# Altium schematic sheet ASBB_BMP388.SchDoc
size A4
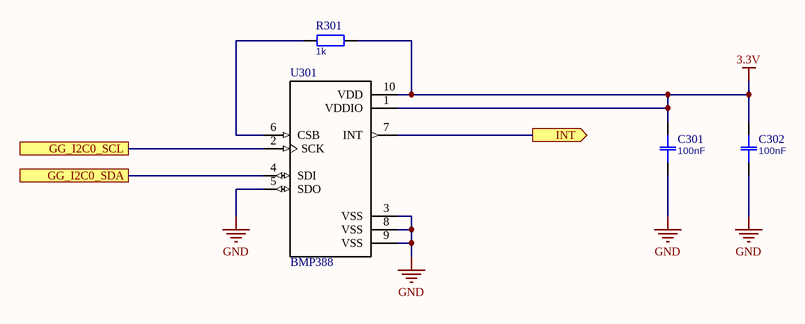
[diagram p0: ASBB_BMP388.SchDoc]

## Parts
C301  100nF  [0603]
C302  100nF  [0603]
R301  1k  [0603]
U301  BMP388  [PQFN50P200X200X80-10N]

## Ports
GG_I2C0_SCL, GG_I2C0_SDA, INT (out)

## Nets
3.3V: C301.2 C302.2 R301.2 U301.1(VDDIO) U301.10(VDD)
GND: C301.1 C302.1 U301.3(VSS) U301.5(SDO) U301.8(VSS) U301.9(VSS)
GG_I2C0_SCL: U301.2(SCK) ; port GG_I2C0_SCL
GG_I2C0_SDA: U301.4(SDI) ; port GG_I2C0_SDA
INT: U301.7(INT) ; port INT
NetR301_1: R301.1 U301.6(CSB)

## Library data of the parts
C301 C302 = Capacitor: Partnumber: ?; Value: ?
R301 = Resistor: Partnumber: ?; Value: ?
U301 = BMP388: P-Sensor SPI I2C 1, 25 Bar SMD; MF: Bosch Sensortec; MP: BMP388; Availability: Unavailable; SnapEDA_Link: https://www.snapeda.com/parts/BMP388/Bosch%20Sensortec/view-part/?ref=snap; Package: WFLGA-10 Bosch Tools; Price: None; Value: *